# EAGLE design KW2CPU.PCB (EAGLE 6.5.0)
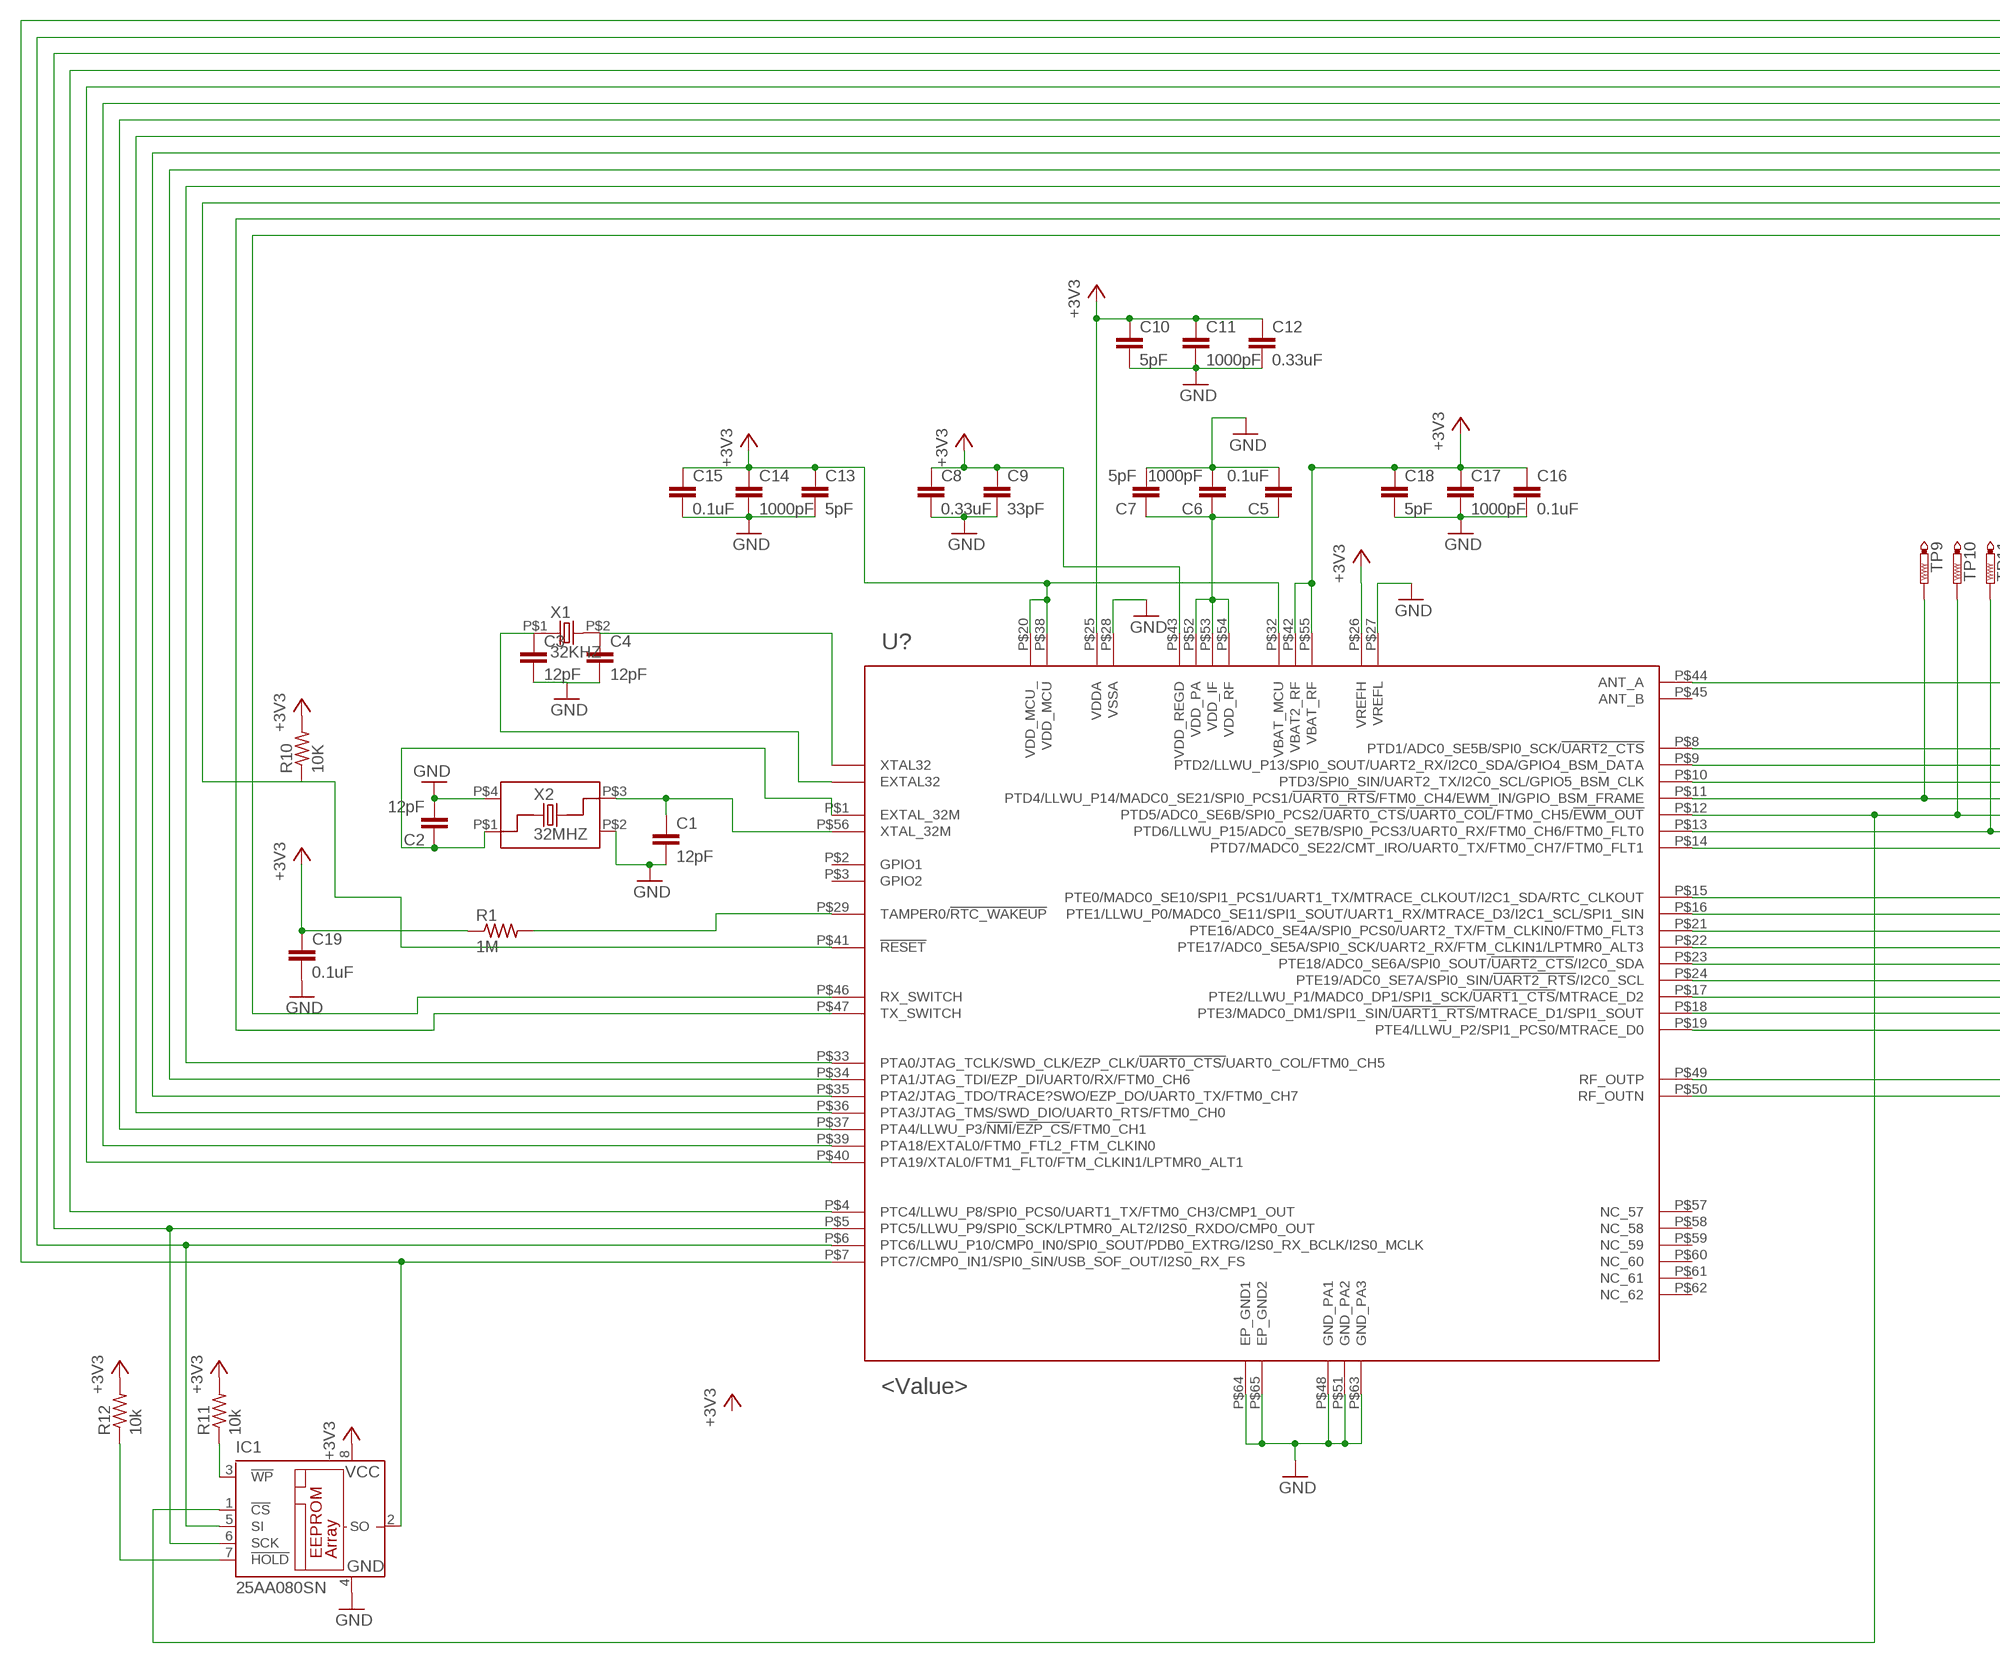
[diagram p0: schematic, sheet 1, part 1 of 2]
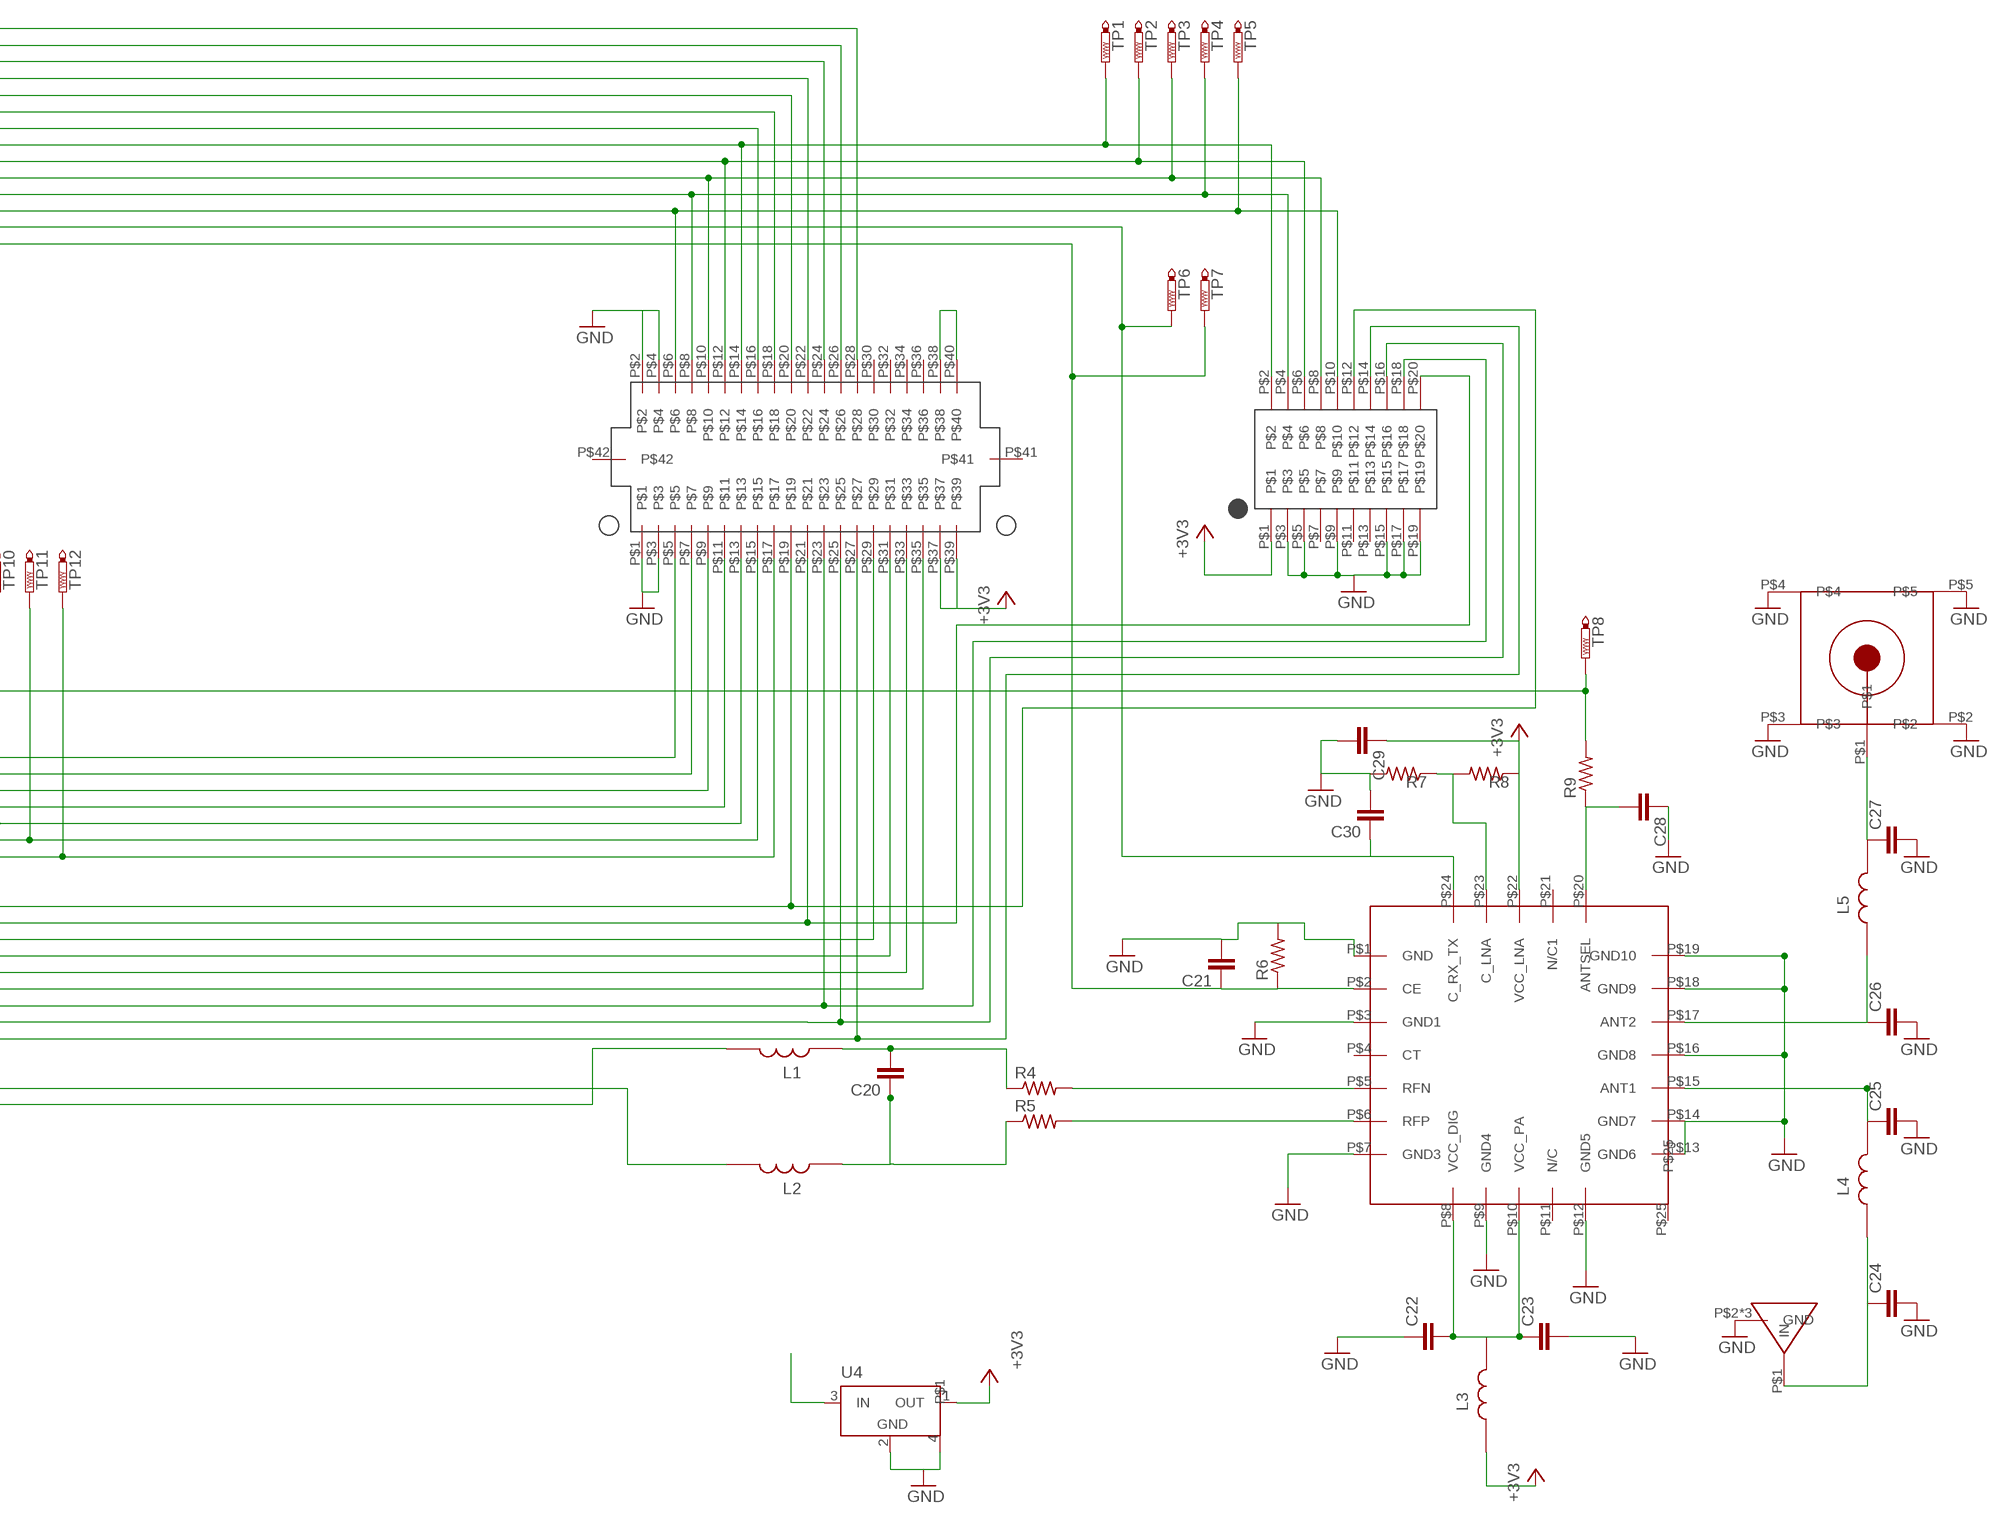
[diagram p1: schematic, sheet 1, part 2 of 2]

## Parts
C1  12pF  RF-C0402  [C0402]
C2  12pF  RF-C0402  [C0402]
C3  12pF  RF-C0402  [C0402]
C4  12pF  RF-C0402  [C0402]
C5  0.1uF  RF-C0402  [C0402]
C6  1000pF  RF-C0402  [C0402]
C7  5pF  RF-C0402  [C0402]
C8  0.33uF  RF-C0402  [C0402]
C9  33pF  RF-C0402  [C0402]
C10  5pF  RF-C0402  [C0402]
C11  1000pF  RF-C0402  [C0402]
C12  0.33uF  RF-C0402  [C0402]
C13  5pF  RF-C0402  [C0402]
C14  1000pF  RF-C0402  [C0402]
C15  0.1uF  RF-C0402  [C0402]
C16  0.1uF  RF-C0402  [C0402]
C17  1000pF  RF-C0402  [C0402]
C18  5pF  RF-C0402  [C0402]
C19  0.1uF  RF-C0402  [C0402]
C20  RF-C  [RF-L0201]
C21  RF-CRFMD  [RFMD0402]
C22  RF-C  [RF-L0201]
C23  RF-C  [RF-L0201]
C24  RF-CRFMD  [RFMD0402]
C25  RF-CRFMD  [RFMD0402]
C26  RF-CRFMD  [RFMD0402]
C27  RF-CRFMD  [RFMD0402]
C28  RF-CRFMD  [RFMD0402]
C29  RF-CRFMD  [RFMD0402]
C30  RF-CRFMD  [RFMD0402]
IC1  25AA080SN  [SO-08]
J1  DF12_M  [DF12_M]
J2  MOLEX55560-0207  [MOLEX55560-0207]
J3  MMCX_VERT  [MMCX_VERT]
L1  RF-L0201  [RF-L0201]
L2  RF-L0201  [RF-L0201]
L3  RF-L  [RFMD0402]
L4  RF-L  [RFMD0402]
L5  RF-L  [RFMD0402]
R1  1M  RF-R0402  [RF-R0402]
R4  RF-R  [RF-L0201]
R5  RF-R  [RF-L0201]
R6  RF-RRFMD  [RFMD0402]
R7  RF-RRFMD  [RFMD0402]
R8  RF-RRFMD  [RFMD0402]
R9  RF-RRFMD  [RFMD0402]
R10  10K  RF-R0402  [RF-R0402]
R11  10k  RF-R0402  [RF-R0402]
R12  10k  RF-R0402  [RF-R0402]
TP1  PTR1TP15R  [TP15R]
TP2  PTR1TP15R  [TP15R]
TP3  PTR1TP15R  [TP15R]
TP4  PTR1TP15R  [TP15R]
TP5  PTR1TP15R  [TP15R]
TP6  PTR1TP15R  [TP15R]
TP7  PTR1TP15R  [TP15R]
TP8  PTR1TP15R  [TP15R]
TP9  PTR1TP15R  [TP15R]
TP10  PTR1TP15R  [TP15R]
TP11  PTR1TP15R  [TP15R]
TP12  PTR1TP15R  [TP15R]
U1  MKW21D  [LGA63]
U3  RF6555  [RF6555]
U4  MCP1804T-3302I  [SOT223]
U5  F-ANTENNA  [F_ANT_RFMD]
X1  32KHZ  [32KHZSMD]
X2  32MHZ  [32MHZSMD]

## Nets
!RESET: J1.P$6 J2.P$10 R10.1 TP5.TP U1.P$41(!RESET)
+3V3: C8.1 C9.1 C10.1 C11.1 C12.1 C13.1 C14.1 C15.1 C16.1 C17.1 C18.1 C19.1 C29.P$1 IC1.8(VCC) J1.P$37 J1.P$39 J2.P$1 L3.P$2 R1.1 R8.P$1 R10.2 R11.2 R12.2 U1.P$20(VDD_MCU_) U1.P$25(VDDA) U1.P$26(VREFH) U1.P$32(VBAT_MCU) U1.P$38(VDD_MCU) U1.P$42(VBAT2_RF) U1.P$43(VDD_REGD) U1.P$55(VBAT_RF) U3.P$22(VCC_LNA) U4.1(OUT)
ANT1: C25.P$1 L4.P$1 U3.P$15(ANT1)
ANT2: C26.P$1 L5.P$2 U3.P$17(ANT2)
ANT_A: R9.P$2 TP8.TP U1.P$44(ANT_A)
ANTSEL: C28.P$2 R9.P$1 U3.P$20(ANTSEL)
C_LNA: R7.P$1 R8.P$2 U3.P$23(C_LNA)
EXTAL32: C3.1 U1.P$31(EXTAL32) X1.P$1
EXTAL_32M: C2.1 U1.P$1(EXTAL_32M) X2.P$1
F_ANT: C24.P$1 L4.P$2 U5.P$1(IN)
GND: C1.2 C2.2 C3.2 C4.2 C5.2 C6.2 C7.2 C8.2 C9.2 C10.2 C11.2 C12.2 C13.2 C14.2 C15.2 C16.2 C17.2 C18.2 C19.2 C21.P$2 C22.P$1 C23.P$2 C24.P$2 C25.P$2 C26.P$2 C27.P$2 C28.P$1 C29.P$2 C30.P$1 IC1.4(GND) J1.P$1 J1.P$2 J1.P$3 J1.P$4 J2.P$3 J2.P$5 J2.P$9 J2.P$15 J2.P$17 J2.P$19 J3.P$2 J3.P$3 J3.P$4 J3.P$5 R6.P$2 R7.P$2 U1.P$27(VREFL) U1.P$28(VSSA) U1.P$48(GND_PA1) U1.P$51(GND_PA2) U1.P$63(GND_PA3) U1.P$64(EP_GND1) U1.P$65(EP_GND2) U3.P$1(GND) U3.P$3(GND1) U3.P$7(GND3) U3.P$9(GND4) U3.P$12(GND5) U3.P$13(GND6) U3.P$14(GND7) U3.P$16(GND8) U3.P$18(GND9) U3.P$19(GND10) U4.2(GND) U4.4 U5.P$2(GND) U5.P$3(GND) U5.P$4(GND) X2.P$2 X2.P$4
MMCX_ANT: C27.P$1 J3.P$1 L5.P$1
N$1: IC1.3(!WP) R11.1
N$2: IC1.7(!HOLD) R12.1
N$4: C20.P$2 L1.P$2 R4.P$1
N$5: C20.P$1 L2.P$2 R5.P$1
N$6: C5.1 C6.1 C7.1 U1.P$52(VDD_PA) U1.P$53(VDD_IF) U1.P$54(VDD_RF)
PTA0/JTAG_TCLK/SWD_CLK/EZP_CLK/!UART0_CTS/!UART0_COL/FTM0_CH5: J1.P$8 J2.P$4 TP4.TP U1.P$33(PTA0/JTAG_TCLK/SWD_CLK/EZP_CLK/!UART0_CTS/!UART0_COL/FTM0_CH5)
PTA1/JTAG_TDI/EZP_DI/UART0/RX/FTM0_CH6: J1.P$10 J2.P$8 TP3.TP U1.P$34(PTA1/JTAG_TDI/EZP_DI/UART0/RX/FTM0_CH6)
PTA2/JTAG_TDO/TRACE?SWO/EZP_DO/UART0_TX/FTM0_CH7: J1.P$12 J2.P$6 TP2.TP U1.P$35(PTA2/JTAG_TDO/TRACE?SWO/EZP_DO/UART0_TX/FTM0_CH7)
PTA3/JTAG_TMS/SWD_DIO/UART0_RTS/FTM0_CH0: J1.P$14 J2.P$2 TP1.TP U1.P$36(PTA3/JTAG_TMS/SWD_DIO/UART0_RTS/FTM0_CH0)
PTA4/LLWU_P3/!NMI!/!EZP_CS!/FTM0_CH1: J1.P$16 U1.P$37(PTA4/LLWU_P3/!NMI!/!EZP_CS!/FTM0_CH1)
PTA18/EXTAL0/FTM0_FTL2_FTM_CLKIN0: J1.P$18 U1.P$39(PTA18/EXTAL0/FTM0_FTL2_FTM_CLKIN0)
PTA19/XTAL0/FTM1_FLT0/FTM_CLKIN1/LPTMR0_ALT1: J1.P$20 U1.P$40(PTA19/XTAL0/FTM1_FLT0/FTM_CLKIN1/LPTMR0_ALT1)
PTC4/LLWU_P8/SPI0_PCS0/UART1_TX/FTM0_CH3/CMP1_OUT: J1.P$22 U1.P$4(PTC4/LLWU_P8/SPI0_PCS0/UART1_TX/FTM0_CH3/CMP1_OUT)
PTC5/LLWU_P8/SPI0_PCS0/UART1_TX/FTM0_CH3/CMP1_OUT: IC1.6(SCK) J1.P$24 U1.P$5(PTC5/LLWU_P9/SPI0_SCK/LPTMR0_ALT2/I2S0_RXDO/CMP0_OUT)
PTC6/LLWU_P10/CMP0_IN0/SPI0_SOUT/PDB0_EXTRG/I2S0_RX_BCLK/I2S0_MCLK: IC1.5(SI) J1.P$26 U1.P$6(PTC6/LLWU_P10/CMP0_IN0/SPI0_SOUT/PDB0_EXTRG/I2S0_RX_BCLK/I2S0_MCLK)
PTC7/CMP0_IN1/SPI0_SIN/USB_SOF_OUT/I2S0_RX_FS: IC1.2(SO) J1.P$28 U1.P$7(PTC7/CMP0_IN1/SPI0_SIN/USB_SOF_OUT/I2S0_RX_FS)
PTD1/ADC0_SE5B/SPI0_SCK/!UART2_CTS: J1.P$5 U1.P$8(PTD1/ADC0_SE5B/SPI0_SCK/!UART2_CTS)
PTD2/LLWU_P13/SPI0_SOUT/UART2_RX/I2C0_SDA/GPIO4_BSM_DATA: J1.P$7 U1.P$9(PTD2/LLWU_P13/SPI0_SOUT/UART2_RX/I2C0_SDA/GPIO4_BSM_DATA)
PTD3/SPI0_SIN/UART2_TX/I2C0_SCL/GPIO5_BSM_CLK: J1.P$9 U1.P$10(PTD3/SPI0_SIN/UART2_TX/I2C0_SCL/GPIO5_BSM_CLK)
PTD4/LLWU_P14/MADC0_SE21/SPI0_PCS1/!UART0_RTS!/FTM0_CH4/EWM_IN/GPIO_BSM_FRAME: J1.P$11 TP9.TP U1.P$11(PTD4/LLWU_P14/MADC0_SE21/SPI0_PCS1/!UART0_RTS!/FTM0_CH4/EWM_IN/GPIO_BSM_FRAME)
PTD5/ADC0_SE6B/SPI0_PCS2/!UART0_CTS!/!UART0_COL!/FTM0_CH5/!EWM_OUT: IC1.1(!CS) J1.P$13 TP10.TP U1.P$12(PTD5/ADC0_SE6B/SPI0_PCS2/!UART0_CTS!/!UART0_COL!/FTM0_CH5/!EWM_OUT)
PTD6/LLWU_P15/ADC0_SE7B/SPI0_PCS3/UART0_RX/FTM0_CH6/FTM0_FLT0: J1.P$15 TP11.TP U1.P$13(PTD6/LLWU_P15/ADC0_SE7B/SPI0_PCS3/UART0_RX/FTM0_CH6/FTM0_FLT0)
PTD7/MADC0_SE22/CMT_IRO/UART0_TX/FTM0_CH7/FTM0_FLT1: J1.P$17 TP12.TP U1.P$14(PTD7/MADC0_SE22/CMT_IRO/UART0_TX/FTM0_CH7/FTM0_FLT1)
PTE0/MADC0_SE10/SPI1_PCS1/UART1_TX/MTRACE_CLKOUT/I2C1_SDA/RTC_CLKOUT: J1.P$19 J2.P$12 U1.P$15(PTE0/MADC0_SE10/SPI1_PCS1/UART1_TX/MTRACE_CLKOUT/I2C1_SDA/RTC_CLKOUT)
PTE1/LLWU_P0/MADC0_SE11/SPI1_SOUT/UART1_RX/MTRACE_D3/I2C1_SCL/SPI1_SIN: J1.P$21 J2.P$20 U1.P$16(PTE1/LLWU_P0/MADC0_SE11/SPI1_SOUT/UART1_RX/MTRACE_D3/I2C1_SCL/SPI1_SIN)
PTE2/LLWU_P1/MADC0_DP1/SPI1_SCK/!UART1_CTS!/MTRACE_D2: J1.P$23 J2.P$18 U1.P$17(PTE2/LLWU_P1/MADC0_DP1/SPI1_SCK/!UART1_CTS!/MTRACE_D2)
PTE3/MADC0_DM1/SPI1_SIN/!UART1_RTS!/MTRACE_D1/SPI1_SOUT: J1.P$25 J2.P$16 U1.P$18(PTE3/MADC0_DM1/SPI1_SIN/!UART1_RTS!/MTRACE_D1/SPI1_SOUT)
PTE4/LLWU_P2/SPI1_PCS0/MTRACE_D0: J1.P$27 J2.P$14 U1.P$19(PTE4/LLWU_P2/SPI1_PCS0/MTRACE_D0)
PTE16/ADC0_SE4A/SPI0_PCS0/UART2_TX/FTM_CLKIN0/FTM0_FLT3: J1.P$29 U1.P$21(PTE16/ADC0_SE4A/SPI0_PCS0/UART2_TX/FTM_CLKIN0/FTM0_FLT3)
PTE17/ADC0_SE5A/SPI0_SCK/UART2_RX/FTM_CLKIN1/LPTMR0_ALT3: J1.P$31 U1.P$22(PTE17/ADC0_SE5A/SPI0_SCK/UART2_RX/FTM_CLKIN1/LPTMR0_ALT3)
PTE18/ADC0_SE6A/SPI0_SOUT/!UART2_CTS!/I2C0_SDA: J1.P$33 U1.P$23(PTE18/ADC0_SE6A/SPI0_SOUT/!UART2_CTS!/I2C0_SDA)
PTE19/ADC0_SE7A/SPI0_SIN/!UART2_RTS!/I2C0_SCL: J1.P$35 U1.P$24(PTE19/ADC0_SE7A/SPI0_SIN/!UART2_RTS!/I2C0_SCL)
RF_OUTN: L1.P$1 U1.P$50(RF_OUTN)
RF_OUTP: L2.P$1 U1.P$49(RF_OUTP)
RFN: R4.P$2 U3.P$5(RFN)
RFP: R5.P$2 U3.P$6(RFP)
RX_SWITCH: C21.P$1 R6.P$1 TP7.TP U1.P$46(RX_SWITCH) U3.P$2(CE)
TAMPER/!RTC_WAKEUP: R1.2 U1.P$29(TAMPER0/!RTC_WAKEUP)
TX_SWITCH: C30.P$2 TP6.TP U1.P$47(TX_SWITCH) U3.P$24(C_RX_TX)
VCC_DIG_PA: C22.P$2 C23.P$1 L3.P$1 U3.P$8(VCC_DIG) U3.P$10(VCC_PA)
VIN: J1.P$38 J1.P$40 U4.3(IN)
XTAL32: C4.1 U1.P$30(XTAL32) X1.P$2
XTAL_32M: C1.1 U1.P$56(XTAL_32M) X2.P$3
Unconnected: J1.P$30 J1.P$32 J1.P$34 J1.P$36 J1.P$41 J1.P$42 J2.P$7 J2.P$11 J2.P$13 U1.P$2(GPIO1) U1.P$3(GPIO2) U1.P$45(ANT_B) U1.P$57(NC_57) U1.P$58(NC_58) U1.P$59(NC_59) U1.P$60(NC_60) U1.P$61(NC_61) U1.P$62(NC_62) U3.P$4(CT) U3.P$11(N/C) U3.P$21(N/C1) U3.P$25

## Library data of the parts
C1-C19 = GW-devices:RF-C: RF capacitor pads for FSL reference design
C20 = GW-devices:RF-C: RF capacitor pads for FSL reference design; MFGN: TDK; MFGP: C0603C0G1E1R2B030BF
C21 C28-C30 = GW-devices:RF-C: RF capacitor pads for FSL reference design; MFGN: Murata; MFGP: GJM1555C1H8R0CB01D
C22 = GW-devices:RF-C: RF capacitor pads for FSL reference design; MFGN: TDK; MFGP: C0603X5R0J105M030BC
C23 = GW-devices:RF-C: RF capacitor pads for FSL reference design; MFGN: TDK; MFGP: C0603C0G1E5R1C030BG
C24 C25 C27 = GW-devices:RF-C: RF capacitor pads for FSL reference design; NOTES: DNP
C26 = GW-devices:RF-C: RF capacitor pads for FSL reference design; NOTE: DNP
IC1 = microchip:25*: Serial EEPROM 4K/ 8K , SPI bus; MF: MICROCHIP; MPN: 25AA080/SN; OC_FARNELL: 1816072; OC_NEWARK: 92C7351
J1 = KW2:DF12_M
J2 = KW2:MOLEX55560-0207
J3 = KW2:MMCX_VERT; MFGN: Molex; MFGP: 0734152061
L1 L2 = GW-devices:RF-L: RF inductor pads for FSL reference design; MFGN: Murata; MFGP: LQP03TN1N0B02
L3 = GW-devices:RF-L: RF inductor pads for FSL reference design; MFGN: Murata; MFGP: BLM15AG100SN1D
L4 L5 = GW-devices:RF-L: RF inductor pads for FSL reference design
R1 R10-R12 = GW-devices:RF-R: RF resistor pads for FSL reference design
R4 R5 = GW-devices:RF-R: RF resistor pads for FSL reference design; MFGN: Panasonic; MFGP: ERJ-1GN0R00C
R6-R9 = GW-devices:RF-R: RF resistor pads for FSL reference design; MFGN: Panasonic; MFGP: ERJ-2GEJ513X
TP1-TP12 = testpad:PTR1: TEST PIN
U1 = ZIGBEE:MKW21D: Freescale's new Kinetis KW20 wireless MCUs expands on the successful Kinetis MCU family based on the ARM® Cortex-M4 CPU core. The Kinetis KW20 Wireless MCU integrates a class-leading RF transceiver, Cortex-M4 and a robust feature set for reliable, secure, and low-power IEEE® 802.15.4 wireless solutions. Product Summary Page: http://www.freescale.com/webapp/sps/site/prod_summary.jsp?code=KW20 Datasheet: http://cache.freescale.com/files/rf_if/doc/data_sheet/MKW22D512V.pdf
U3 = KW2:RF6555; MFGN: RFMD; MFGP: RF6555
U4 = microchip:MCP1804T-3302I: VOLTAGE REGULATOR; MPN: MCP1804T-3302I
U5 = KW2:F-ANTENNA: PCB-base F-Antenna
X1 = KW2:32KHZ
X2 = KW2:32MHZ: 32Mhz crystal for KW2 radio; MFGN: NDK; MFGP: EXS00A-CS02368

## Board
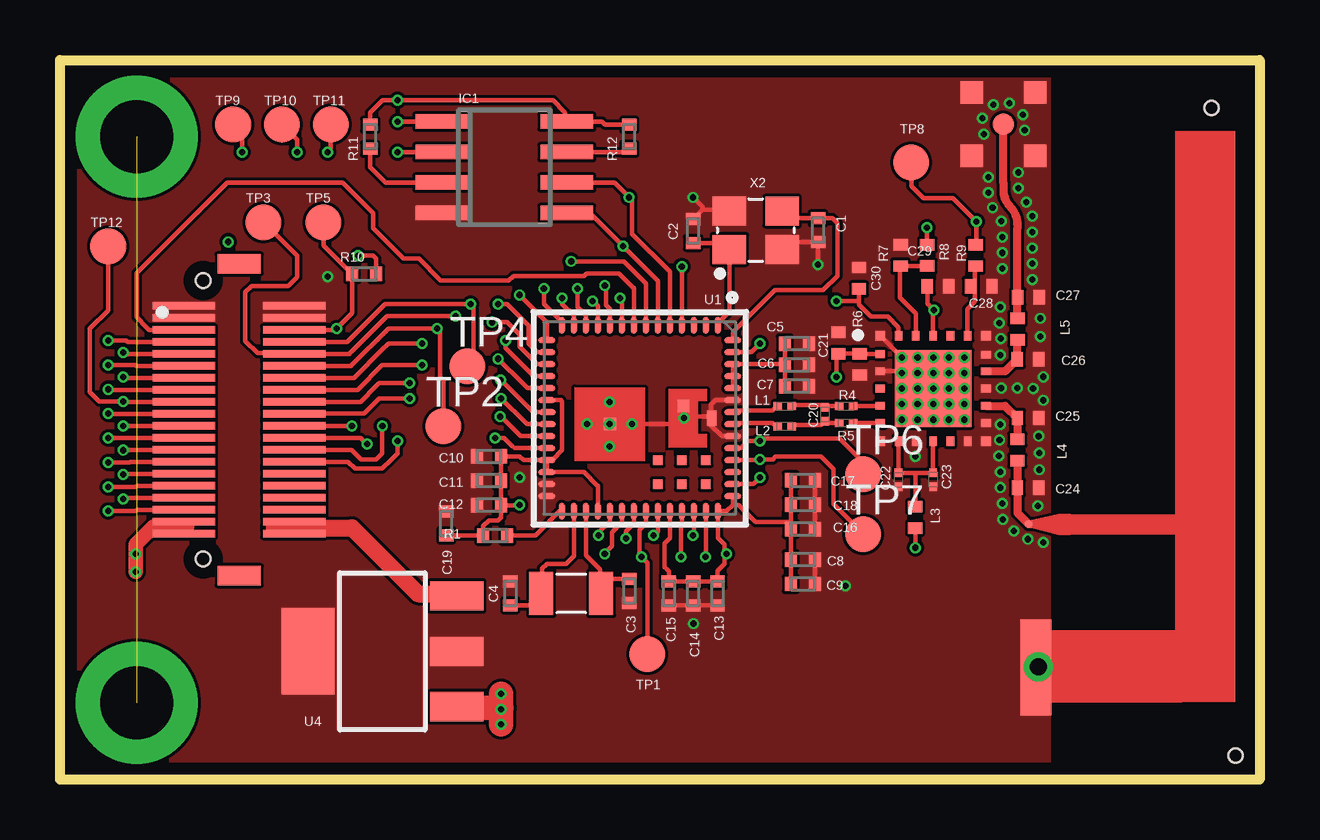
[diagram p2: board, top side]
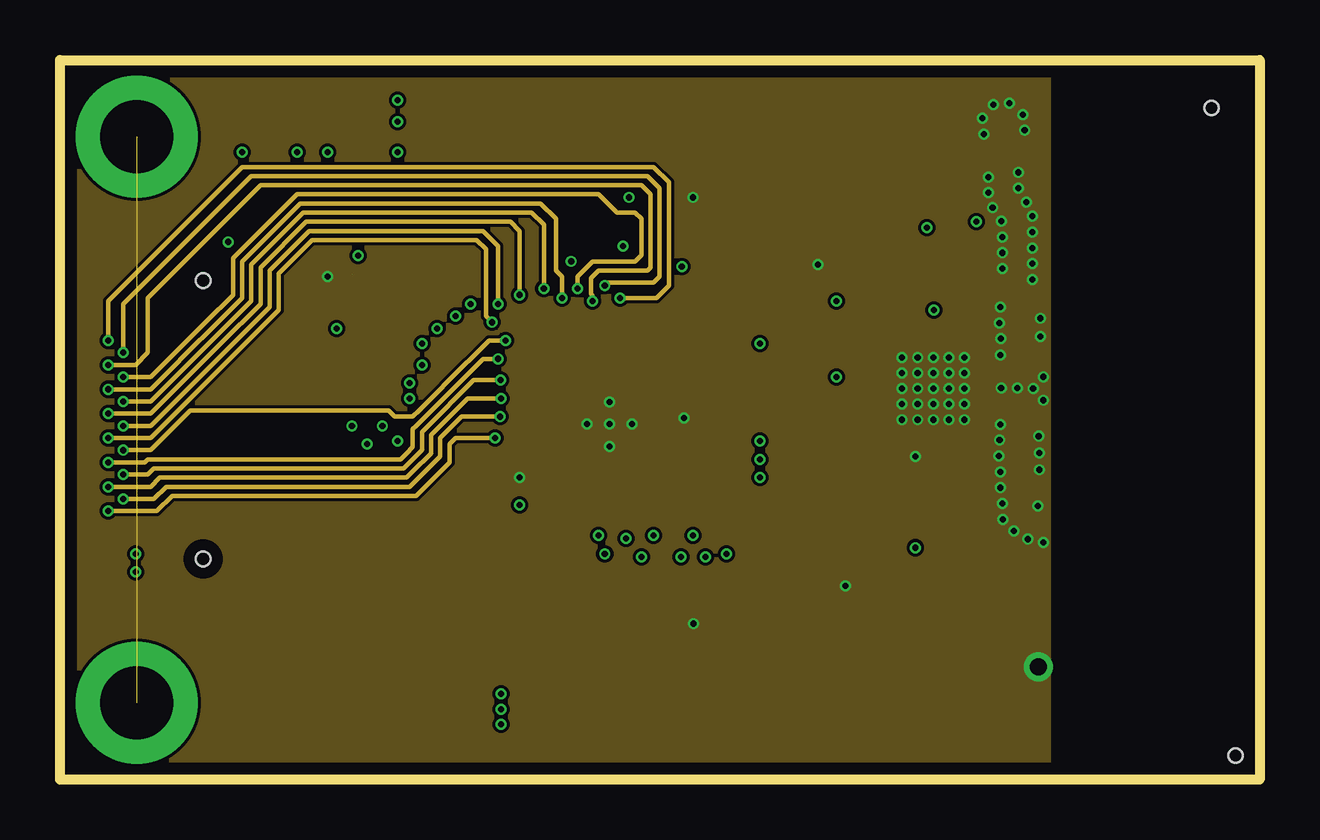
[diagram p3: board, inner layer Route2]
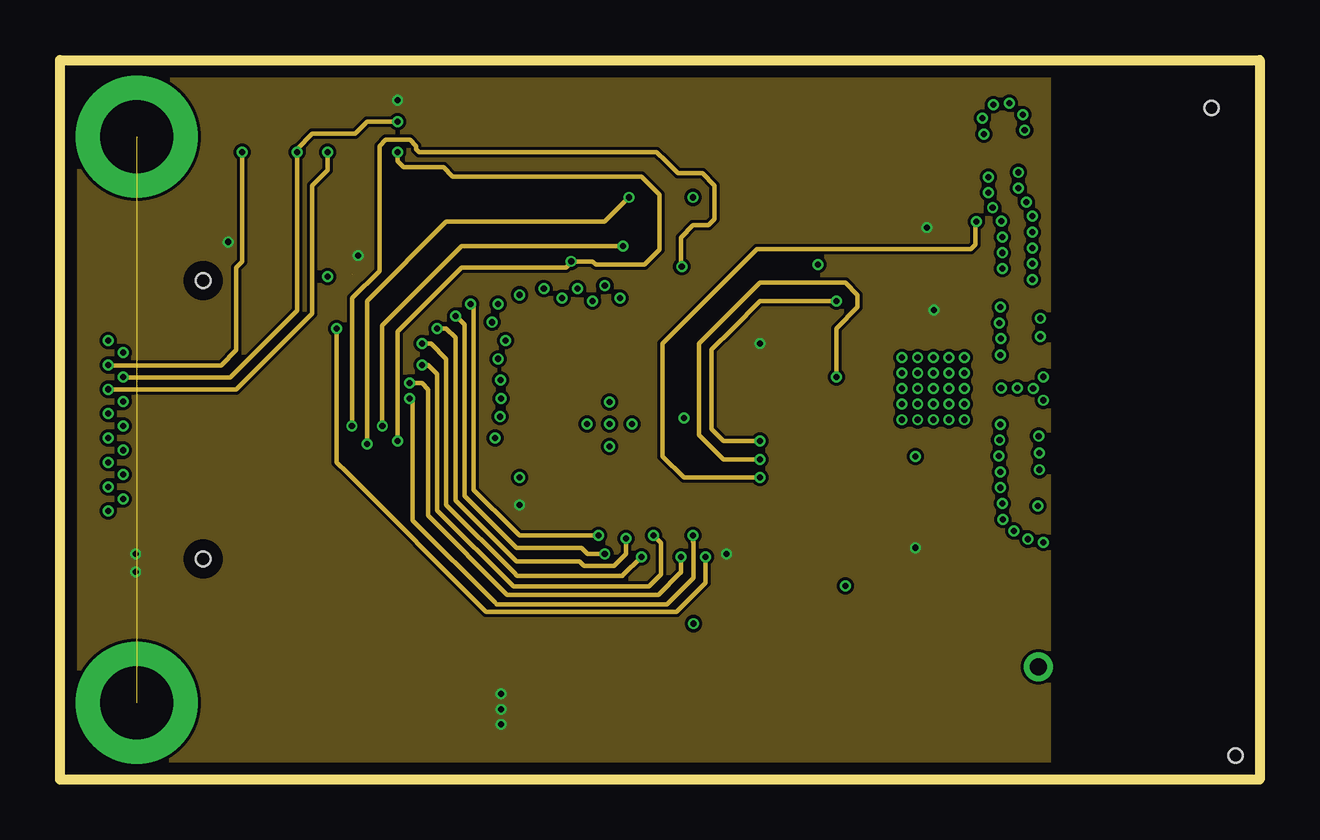
[diagram p4: board, inner layer Route3]
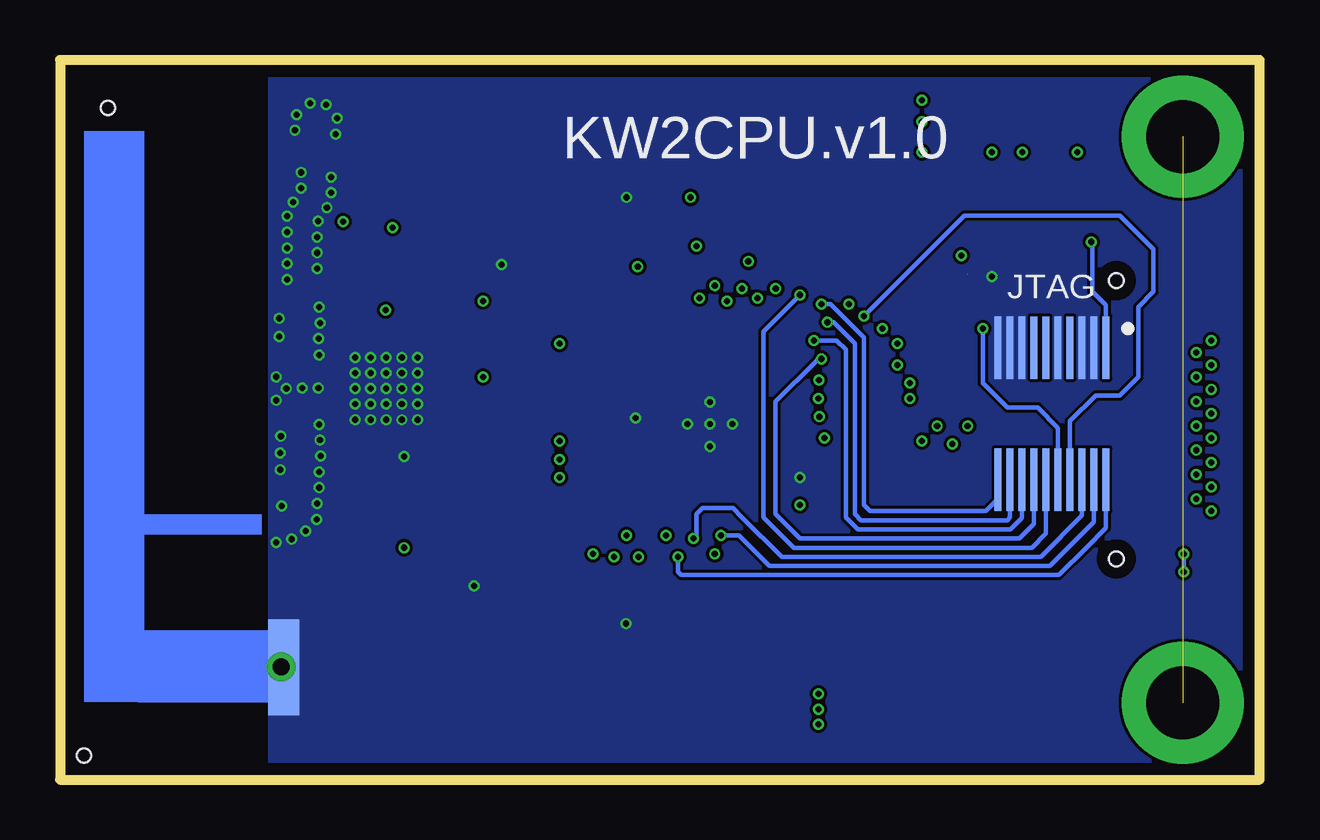
[diagram p5: board, bottom side, seen from below]

Size 50 x 30 mm. Coordinates in mm from the lower left corner, seen from the top.
Outline: 0,30 50,30 50,0 0,0 0,30
Copper layers (1*2*3*16): Top 0.035559375mm / dielectric 10mil / Route2 0.035559375mm / dielectric 38mil / Route3 0.035559375mm / dielectric 10mil / Bottom 0.035559375mm
Design rules "SilverCircuits *": minimum track width 5mil, minimum drill 4mil, track to track 5mil, track to pad 5mil, pad to pad 5mil, via to via 5mil, smd to smd 0mil, copper to edge 20mil, drill to drill 8mil, minimum pad ring 10mil, minimum via ring 4mil, stop-mask expansion 4mil, vias tented up to drill 0mil, thermal gap 10mil
Holes 0.6 mm at 48,28 49,1

### Footprints (pad centres in the part's own frame; a part is rotated, then mirrored left to right if it is on the bottom)
C0402 = smd 0.5 x 0.6: 1 -0.5,0; 2 0.5,0
RF-L0201 = smd 0.33 x 0.356: P$1 0,-0.29; P$2 0,0.29
RFMD0402 = smd 0.475 x 0.6: P$1 -0.445,0; P$2 0.445,0
SO-08 = smd 0.6 x 2.2: 1 -1.905,-2.6; 2 -0.635,-2.6; 3 0.635,-2.6; 4 1.905,-2.6; 5 1.905,2.6; 6 0.635,2.6; 7 -0.635,2.6; 8 -1.905,2.6
DF12_M = smd 0.3 x 2.6: P$1 4.75,2.3; P$2 4.75,-2.3; P$3 4.25,2.3; P$4 4.25,-2.3; P$5 3.75,2.3; P$6 3.75,-2.3; P$7 3.25,2.3; P$8 3.25,-2.3; P$9 2.75,2.3; P$10 2.75,-2.3; P$11 2.25,2.3; P$12 2.25,-2.3; P$13 1.75,2.3; P$14 1.75,-2.3; P$15 1.25,2.3; P$16 1.25,-2.3; P$17 0.75,2.3; P$18 0.75,-2.3; P$19 0.25,2.3; P$20 0.25,-2.3; P$21 -0.25,2.3; P$22 -0.25,-2.3; P$23 -0.75,2.3; P$24 -0.75,-2.3; P$25 -1.25,2.3; P$26 -1.25,-2.3; P$27 -1.75,2.3; P$28 -1.75,-2.3; P$29 -2.25,2.3; P$30 -2.25,-2.3; P$31 -2.75,2.3; P$32 -2.75,-2.3; P$33 -3.25,2.3; P$34 -3.25,-2.3; P$35 -3.75,2.3; P$36 -3.75,-2.3; P$37 -4.25,2.3; P$38 -4.25,-2.3; P$39 -4.75,2.3; P$40 -4.75,-2.3 | smd 0.8 x 1.8: P$41 -6.5,0; P$42 6.5,0 | hole 0.6: -5.8,1.5; 5.8,1.5
MOLEX55560-0207 = smd 0.3 x 2.6: P$1 -2.25,-2.75; P$2 -2.25,2.75; P$3 -1.75,-2.75; P$4 -1.75,2.75; P$5 -1.25,-2.75; P$6 -1.25,2.75; P$7 -0.75,-2.75; P$8 -0.75,2.75; P$9 -0.25,-2.75; P$10 -0.25,2.75; P$11 0.25,-2.75; P$12 0.25,2.75; P$13 0.75,-2.75; P$14 0.75,2.75; P$15 1.25,-2.75; P$16 1.25,2.75; P$17 1.75,-2.75; P$18 1.75,2.75; P$19 2.25,-2.75; P$20 2.25,2.75
MMCX_VERT = smd 0.89 x 0.89: P$1 0,0 | smd 0.94 x 0.94: P$2 -1.32,1.32; P$3 1.32,1.32; P$4 1.32,-1.32; P$5 -1.32,-1.32
RF-R0402 = smd 0.5 x 0.6: 1 -0.5,0; 2 0.5,0
TP15R = smd 1.5 x 1.5: TP 0,0
LGA63 = smd 0.711 x 0.254: P$1 0.125,7.25; P$2 0.125,6.75; P$3 0.125,6.25; P$4 0.125,5.75; P$5 0.125,5.25; P$6 0.125,4.75; P$7 0.135,4.25; P$8 0.135,3.75; P$9 0.125,3.25; P$10 0.125,2.75; P$11 0.125,2.25; P$12 0.125,1.75; P$13 0.125,1.25; P$14 0.125,0.75; P$29 7.875,0.75; P$30 7.875,1.25; P$31 7.875,1.75; P$32 7.875,2.25; P$33 7.875,2.75; P$34 7.875,3.25; P$35 7.885,3.75; P$36 7.885,4.25; P$37 7.875,4.75; P$38 7.875,5.25; P$39 7.875,5.75; P$40 7.875,6.25; P$41 7.875,6.75; P$42 7.875,7.25 | smd 0.254 x 0.711: P$15 0.75,0.125; P$16 1.25,0.125; P$17 1.75,0.125; P$18 2.25,0.125; P$19 2.75,0.125; P$20 3.25,0.125; P$21 3.75,0.135; P$22 4.25,0.135; P$23 4.75,0.125; P$24 5.25,0.125; P$25 5.75,0.125; P$26 6.25,0.125; P$27 6.75,0.125; P$28 7.25,0.125; P$43 7.25,7.875; P$44 6.75,7.875; P$45 6.25,7.875; P$46 5.75,7.875; P$47 5.25,7.874; P$48 4.751,7.874; P$49 4.25,7.874; P$50 3.75,7.875; P$51 3.25,7.875; P$52 2.75,7.875; P$53 2.25,7.875; P$54 1.75,7.875; P$55 1.25,7.875; P$56 0.75,7.875 | smd 0.406 x 0.406: P$57 5.75,6.75; P$58 6.75,6.75; P$59 5.75,5.75; P$60 6.75,5.75; P$61 5.75,4.75; P$62 6.75,4.75 | smd 0.66 x 0.406: P$63 4,7 | smd 0.5 x 0.5: P$64 3.5,5.812; P$65 4.25,2.75
RF6555 = smd 0.4 x 0.4: P$1 -2.2,2.2; P$7 -2.2,-2.2; P$13 2.2,-2.2; P$19 2.2,2.2 | smd 0.4 x 0.32: P$2 -2.2,1.44; P$3 -2.2,0.72; P$4 -2.2,0; P$5 -2.2,-0.72; P$6 -2.2,-1.44; P$14 2.2,-1.44; P$15 2.2,-0.72; P$16 2.2,0; P$17 2.2,0.72; P$18 2.2,1.4 | smd 0.32 x 0.4: P$8 -1.44,-2.2; P$9 -0.72,-2.2; P$10 0,-2.2; P$11 0.72,-2.2; P$12 1.44,-2.2; P$20 1.44,2.2; P$21 0.72,2.2; P$22 0,2.2; P$23 -0.72,2.2; P$24 -1.44,2.2 | smd 3.2 x 3.2: P$25 0,0
SOT223 = smd 1.219 x 2.235: 1 -2.311,-3.099; 2 0,-3.099; 3 2.311,-3.099 | smd 3.6 x 2.2: 4 0,3.099
F_ANT_RFMD = smd 0.333 x 0.333: P$1 -3.912,2.68 | smd 1.3 x 4 bottom: P$2 -3.609,-3.302 | drill 0.711 pad 0.965: P$3 -3.501,-3.272 | smd 1.3 x 4: P$4 -3.609,-3.302
32KHZSMD = smd 1 x 1.8: P$1 1.25,0; P$2 -1.25,0
32MHZSMD = smd 1.4 x 1.2: P$1 -1.1,-0.8; P$2 1.1,-0.8; P$3 1.1,0.8; P$4 -1.1,0.8

### Placement (x,y rotation side)
C1  31.6,22.9 270 top
C2  26.39,22.87 90 top
C3  23.73,7.86 270 top
C4  18.77,7.76 90 top
C5  30.71,18.18 0 top
C6  30.71,17.29 0 top
C7  30.71,16.4 0 top
C8  30.96,9.17 0 top
C9  30.96,8.16 0 top
C10  17.88,13.48 180 top
C11  17.88,12.46 180 top
C12  17.88,11.44 180 top
C13  27.41,7.76 270 top
C14  26.39,7.76 270 top
C15  25.38,7.76 270 top
C16  30.96,10.44 0 top
C17  30.96,12.48 0 top
C18  30.96,11.46 0 top
C19  16.1,10.68 90 top
C20  31.88,15.22 0 top
C21  32.45,18.19 90 top
C22  34.95,12.5 0 top
C23  36.39,12.5 180 top
C24  40.35,12.17 0 top
C25  40.35,15.07 0 top
C26  40.34,17.52 0 top
C27  40.37,20.11 0 top
C28  38.4,20.57 180 top
C29  36.6,20.56 0 top
C30  33.3,20.9 270 top
IC1  18.52,25.52 270 top
J1  7.47,15 90 top
J2  8.65,15.25 180 bottom
J3  39.32,27.32 0 top
L1  30.22,15.56 270 top
L2  30.22,14.73 270 top
L3  35.65,10.93 270 top
L4  39.91,13.74 270 top
L5  39.91,18.78 270 top
R1  18.14,10.17 0 top
R4  32.77,15.56 270 top
R5  32.77,14.86 270 top
R6  33.33,17.31 270 top
R7  35.04,21.85 90 top
R8  36.15,21.85 270 top
R9  38.16,21.85 90 top
R10  12.68,21.08 0 top
R11  12.93,26.8 90 top
R12  23.73,26.8 90 top
TP1  24.49,5.24 0 top
TP2  15.99,14.74 0 top
TP3  8.49,23.24 0 top
TP4  16.99,17.24 0 top
TP5  10.99,23.24 0 top
TP6  33.49,12.74 0 top
TP7  33.49,10.24 0 top
TP8  35.49,25.74 0 top
TP9  7.22,27.3 0 top
TP10  9.25,27.3 0 top
TP11  11.28,27.3 0 top
TP12  2.01,22.22 0 top
U1  20.17,19.06 270 top
U3  36.39,16.3 0 top
U4  13.44,5.35 90 top
U5  44.28,7.97 0 top
X1  21.31,7.76 0 top
X2  29,22.9 0 top

### Tracks (layer width: path | path; a pad name or v marks a point on that pad's centre or on a via)
!RESET  (via drill 0.25)  (1 unrouted)
  Top 0.178: U1.P$41 26.92,9.3 v26.9,9.29 | J1.P$6 11.47,18.75 v11.53,18.81 12.17,19.45 12.17,20.32 | TP5.TP 10.99,22.26 R10.1 12.17,20.32 | 12.17,20.57 12.17,20.32
  Route3 0.178: v11.53,18.81 11.53,13.22 11.54,13.21 11.96,12.79 17.75,7 25.7,7 26.9,8.2 v26.9,9.29
  Bottom 0.178: J2.P$10 8.4,14.66 9.25,15.51 10.52,15.51 11.53,16.52 v11.53,18.81
+3V3  (via drill 0.25, 0.25 pad 0.46)
  Top 0.178: U1.P$25 U1.P$26 21.84,12.81 22.39,12.26 22.42,12.23 U1.P$32 | C17.1 C18.1 30.46,10.74 | 36.2,20.52 C29.P$1 36.15,19.84 v36.42,19.57 36.39,19.54 U3.P$22 | C9.1 C8.1 C16.1 30.46,10.74 | 27.7,9.41 27.7,9.8 27.42,10.08 U1.P$42 27.79,11.19 28.04,11.44 | 27.7,9.41 27.7,9 27.4,8.7 C13.1 C14.1 C15.1 25.38,8.68 25.27,8.78 25.2,8.85 25.2,9.85 25.39,10.04 25.42,10.07 U1.P$38 | J1.P$37 5.17,10.55 | 5.17,10.55 J1.P$39 | U1.P$20 20.88,15.81 20.93,15.76 20.93,13.73 20.55,13.35 20.3,13.35 20.29,13.34 U1.P$25 | U1.P$25 19.31,13.31 19.15,13.48 C10.1 C11.1 C12.1 18.39,11.44 | C19.1 R1.1 17.64,10.56 17.88,10.81 18.26,10.81 18.39,10.94 18.39,11.44 | 28.04,11.44 U1.P$43 | v27.79,9.41 27.7,9.41 | 5.31,10.55 5.17,10.55 | 16.58,2.99 U4.1 | U1.P$55 28.82,17.81 v29.18,18.18 | L3.P$2 35.65,9.68 v35.66,9.67 | v18.39,2.93 18.39,2.97 18.41,2.99 | 18.39,11.44 19.14,11.44 v19.15,11.44 | R8.P$1 v36.14,23.02 | 28.04,11.44 28.28,11.44 28.99,10.74 30.46,10.74 | R12.2 22.72,27.3 22.59,27.43 IC1.8 21.06,27.49 21.06,27.81 20.55,28.32 v14.08,28.32 13.82,28.32 13.44,28.32 12.93,27.81 R11.2 | v12.42,21.84 13.06,21.84 13.19,21.71 R10.2
  Top 0.61: 5.31,10.55 5.17,10.55 3.91,10.55 3.15,9.79 v3.15,9.41 v3.15,8.65
  Top 1.016: v18.39,3.57 v18.39,2.93 v18.39,2.3 | 18.41,2.99 16.58,2.99
  Bottom 0.178: v3.15,9.41 v3.15,8.65 | J2.P$1 6.4,19.77 6.96,20.33 6.96,21.22 6.96,22.37 v7.01,22.42
  pour Route3 (no thermals): 41.2,2.89 41.2,31.51 -2.37,31.51 -2.37,-1.63 41.2,-1.63 41.2,2.9
ANT1
  Top 0.333: U3.P$15 39.39,15.58 C25.P$1 L4.P$1 39.91,14.11
ANT2
  Top 0.333: U3.P$17 39.4,17.02 39.51,17.13 39.54,17.16 C26.P$1 39.9,18.14 39.91,18.14 L5.P$2
ANT_A  (via drill 0.25)
  Top 0.178: R9.P$2 38.2,22.3 v38.2,23.25 37.22,24.24 35.99,24.24 35.49,24.74 TP8.TP | U1.P$44 28.91,12.31 v29.18,12.59
  Route3 0.178: v29.18,12.59 27.53,12.59 26.01,12.59 25.12,13.48 25.12,18.18 29.06,22.11 37.98,22.11 R9.P$2 38.16,23.21 v38.2,23.25
ANTSEL
  Top 0.178: U3.P$20 37.83,19.61 38.14,19.92 38.14,20.53 | 38.14,20.53 38.14,21.38 R9.P$1 | C28.P$2 38.1,20.57 38.14,20.53
C_LNA
  Top 0.178: R8.P$2 R7.P$1 35,21.37 35,20.1 35.67,19.43 U3.P$23
EXTAL32
  Top 0.178: 22.5,8.38 22.5,8.7 22.5,8.76 21.92,9.34 U1.P$31 | 22.5,8.38 22.5,7.95 | 22.7,7.75 22.57,7.75 X1.P$1 | C3.1 22.52,8.36 22.5,8.38
  Top 0.254: 22.5,7.95 22.7,7.75
EXTAL_32M
  Top 0.178: C2.1 27.63,22.37 X2.P$1 27.9,19.52 27.42,19.03 U1.P$1
  Top 0.254: 27.6,22.4 X2.P$1
F_ANT
  Top 0.333: C24.P$1 | C24.P$1 39.91,11.11 U5.P$1 | L4.P$2 39.91,13.23 39.91,12.47 C24.P$1
GND  (via drill 0.25, 0.25 pad 0.46)
  Top 0.178: C15.2 C14.2 C13.2 | C8.2 C9.2 | C17.2 C18.2 C16.2 | 27.14,15 27.14,14.76 27.59,14.31 U1.P$48 | 27.14,15 27.14,15.13 | 27.14,15.13 27.14,15.63 27.33,15.81 U1.P$51 | 27.14,15.13 26.24,15.13 25.99,14.88 25.93,14.81 U1.P$65 | 30.4,22.4 C1.2 v31.6,21.48 | 25.95,15.42 25.95,15.54 U1.P$64 | U1.P$63 27.17,15.03 27.14,15 | 26.77,23.76 27.84,23.76 X2.P$4 | 26.77,23.76 26.77,23.89 v26.39,24.27 | C2.2 26.77,23.76 | U3.P$3 35.03,17.02 v35.1,16.95 | U3.P$1 v35.1,17.6
  Top 0.254: 25.95,15.42 26.24,15.13 | 30.4,22.4 X2.P$2
  other vias: 37.05,15.65 37.7,15.65 35.1,15 35.75,15 36.4,15 37.05,15 37.7,15 35.75,17.6 36.4,17.6 37.05,17.6 37.7,17.6 35.75,16.95 36.4,16.95 37.05,16.95 37.7,16.95 35.1,16.3 35.75,16.3 36.4,16.3 37.05,16.3 37.7,16.3 35.1,15.65 35.75,15.65 36.4,15.65 32.74,8.07 26.4,6.5 19.15,12.59 35.66,13.48 22.91,14.82 26.01,15.08 21.97,14.82 23.85,14.82 22.91,15.74 22.91,13.88 39.23,16.32 39.9,16.32 40.98,16.79 40.98,15.81 40.86,18.47 40.86,19.23 40.53,20.84 40.53,21.5 40.53,22.16 40.53,22.82 40.53,23.48 40.28,24.08 39.21,17.71 39.17,14.15 39.15,19.04 39.19,19.7 39.28,21.3 39.28,21.96 39.28,22.62 39.24,23.28 38.88,23.84 39.95,24.65 39.14,13.49 39.19,12.83 39.21,12.17 39.28,11.51 39.31,10.85 39.76,10.36 40.34,10.02 40.98,9.88 40.79,14.31 40.82,13.62 40.77,11.41 40.82,12.92 39.94,25.31 39.22,18.38 38.7,24.46 38.7,25.12 38.51,26.91 38.44,27.57 38.91,28.13 39.57,28.2 40.13,27.73 40.21,27.06 39.21,14.81 40.56,16.3 11.15,20.97
  pour Bottom (no thermals): 41.2,2.89 41.2,31.51 -2.37,31.51 -2.37,-1.63 41.2,-1.63 41.2,2.9
  pour Top (no thermals): 41.2,2.89 41.2,31.51 -2.37,31.51 -2.37,-1.63 41.2,-1.63 41.2,2.9
  pour Route2 (no thermals): 41.2,2.89 41.2,31.51 -2.37,31.51 -2.37,-1.63 41.2,-1.63 41.2,2.9
MMCX_ANT
  Top 0.333: L5.P$1 39.91,19.84 39.9,19.84 39.9,19.98 39.92,20 C27.P$1 39.91,20.13 39.91,22.64 39.91,22.95 39.91,23.15 arc45 39.6,23.89 arc-45 39.32,24.55 39.32,24.85 J3.P$1
N$1
  Top 0.178: IC1.3 14.33,24.89 13.57,24.89 12.93,25.52 R11.1 | IC1.3 15.98,24.89 | 15.98,24.89 16.11,24.89 | IC1.3 15.98,24.89
N$2
  Top 0.178: IC1.7 23.59,26.16 R12.1
N$4
  Top 0.178: L1.P$2 30.56,15.62 31.27,15.62 31.73,15.62 31.78,15.62 C20.P$2 31.93,15.56 R4.P$1
N$5
  Top 0.178: R5.P$1 32.31,14.86 31.95,14.86 31.95,14.93 C20.P$1 31.73,14.78 31.66,14.78 30.88,14.78 30.56,14.78 L2.P$2
N$6
  Top 0.178: C5.1 C6.1 | C6.1 C7.1 | U1.P$52 U1.P$53 U1.P$54 30.18,17.31 C6.1 | C6.1 | C6.1 30.07,17.41 | 30.07,17.41 C6.1 | C6.1 30.2,17.16 30.2,17.41 | 30.2,17.41 30.07,17.41 | 30.07,17.41 30.2,17.41
N$55  (via drill 3.05 pad 5.08)  (1 unrouted)
  other vias: 3.2,26.8 3.2,3.2
PTA0/JTAG_TCLK/SWD_CLK/EZP_CLK/!UART0_CTS/!UART0_COL/FTM0_CH5  (via drill 0.25)
  Top 0.178: J1.P$8 11.82,18.25 | 11.82,18.25 11.97,18.25 | 11.97,18.25 11.82,18.25 | 11.82,18.25 11.97,18.25 | 11.97,18.25 13.44,19.72 13.54,19.83 13.95,19.83 v17.12,19.83 17.25,19.7 17.25,17.91 16.58,17.24 TP4.TP | U1.P$33 22.92,10.77 22.45,10.3 v22.45,10.18 v22.45,10.17
  Route3 0.178: v22.45,10.17 22.42,10.17 19.41,10.17 19.15,10.17 18.9,10.43 17.25,12.08 17.25,19.76 17.18,19.83 v17.12,19.83
  Bottom 0.178: J2.P$4 6.9,10.74 8.74,8.9 20.42,8.9 21.69,10.17 v22.45,10.17
PTA1/JTAG_TDI/EZP_DI/UART0/RX/FTM0_CH6  (via drill 0.25)
  Top 0.178: 11.94,17.75 12.02,17.75 | 12.02,17.75 11.94,17.75 | 11.94,17.75 12.02,17.75 | 11.94,17.75 J1.P$10 9.74,17.78 8.23,17.78 7.73,18.29 7.73,20.32 7.98,20.57 9.25,20.57 9.5,20.57 9.88,20.95 9.88,21.84 TP3.TP | v16.48,19.32 13.63,19.32 13.61,19.3 12.07,17.75 12.02,17.75 | v22.71,9.41 22.71,9.46 23,9.75 23,10.3 23.39,10.69 23.42,10.72 U1.P$34
  Route3 0.178: v22.71,9.41 21.99,9.41 21.95,9.45 21.73,9.67 21.61,9.67 19.15,9.67 19.02,9.67 16.87,11.82 16.87,18.56 16.87,18.71 16.87,18.96 16.51,19.32 v16.48,19.32
  Bottom 0.178: J2.P$8 7.9,14.95 6.83,16.02 5.82,16.02 5.05,16.78 5.05,19.7 4.42,20.33 4.42,22.11 5.82,23.51 12.29,23.51 v16.48,19.32
PTA2/JTAG_TDO/TRACE?SWO/EZP_DO/UART0_TX/FTM0_CH7  (via drill 0.25)
  Top 0.178: v23.6,10.05 23.6,10.35 23.89,10.64 23.92,10.67 U1.P$35 | J1.P$12 12.13,17.25 12.14,17.26 13.69,18.81 15.51,18.81 v15.72,18.81 15.85,18.68 15.85,16.76 15.99,16.63 TP2.TP
  Route3 0.178: 15.77,18.81 v15.72,18.81 15.77,18.81 | 15.77,18.81 16.1,18.81 16.48,18.43 16.48,18.18 16.48,17.92 16.48,11.64 19.02,9.1 21.65,9.1 21.85,8.9 23.1,8.9 23.6,9.4 v23.6,10.04 v23.6,10.05
  Bottom 0.178: J2.P$6 7.4,11 9.12,9.29 19.91,9.29 21.56,10.94 21.95,11.32 23.22,11.32 23.47,11.06 23.47,10.17 v23.6,10.05
PTA3/JTAG_TMS/SWD_DIO/UART0_RTS/FTM0_CH0  (via drill 0.25)
  Top 0.178: J1.P$14 12.16,16.75 | 12.16,16.75 12.27,16.75 | 12.27,16.75 12.16,16.75 | 12.16,16.75 12.27,16.75 | 12.27,16.75 13.44,17.92 13.69,18.18 14.98,18.18 v15.09,18.18 | U1.P$36 24.42,10.67 24.39,10.64 24.15,10.4 24.15,9.4 24.23,9.32 v24.23,9.29 24.49,9.03 TP1.TP
  Route3 0.178: v15.09,18.18 15.18,18.18 15.47,18.18 16.1,17.54 16.1,17.29 16.1,11.44 18.92,8.63 19.05,8.5 19.28,8.5 23.45,8.5 v24.23,9.29
  Bottom 0.178: J2.P$2 6.4,10.48 7.21,9.67 8.36,8.52 24.11,8.52 24.23,8.65 v24.23,9.29
PTA4/LLWU_P3/!NMI!/!EZP_CS!/FTM0_CH1  (via drill 0.25)
  Top 0.178: J1.P$16 12.4,16.25 13.44,17.29 v15.09,17.29 | U1.P$37 24.92,10.35 v24.74,10.17
  Route3 0.178: v15.09,17.29 15.34,17.29 15.72,16.91 15.72,11.22 18.9,8.05 24.55,8.05 25.05,8.55 25.05,9.85 25.05,9.86 v24.74,10.17
PTA18/EXTAL0/FTM0_FTL2_FTM_CLKIN0  (via drill 0.25)
  Top 0.178: J1.P$18 12.54,15.75 13.18,16.4 13.31,16.52 14.6,16.52 v14.58,16.52 | U1.P$39 25.92,10.72 25.88,10.68 v25.88,9.29
  Route3 0.178: v14.58,16.52 14.75,16.52 15.09,16.52 15.34,16.27 15.34,16.02 15.34,11.01 18.64,7.7 24.95,7.7 25.85,8.61 25.88,8.64 v25.88,9.29
PTA19/XTAL0/FTM1_FLT0/FTM_CLKIN1/LPTMR0_ALT1  (via drill 0.25)
  Top 0.178: v14.58,15.89 14.6,15.89 13.31,15.89 12.68,15.25 9.71,15.25 J1.P$20 | U1.P$40 26.42,10.2 v26.39,10.17
  Route3 0.178: v26.39,10.17 26.39,9.91 26.4,9.9 26.4,9.8 26.4,8.42 25.3,7.31 18.39,7.31 18.2,7.31 18.14,7.38 14.71,10.81 14.71,10.87 14.71,15.76 14.71,15.77 v14.59,15.89 v14.58,15.89
PTC4/LLWU_P8/SPI0_PCS0/UART1_TX/FTM0_CH3/CMP1_OUT  (via drill 0.25)
  Top 0.178: U1.P$4 25.92,21.33 v25.92,21.38 | J1.P$22 v12.17,14.75
  Route3 0.178: 25.11,25.92 25.25,25.78 | 25.25,25.78 25.76,25.27 26.78,25.27 27.28,24.76 27.28,23.37 27.03,23.11 26.39,23.11 25.89,22.6 25.89,21.41 v25.92,21.38 | 25.25,25.78 24.87,26.16 14.96,26.16 14.84,26.29 14.84,26.41 14.58,26.67 13.57,26.67 13.31,26.41 13.31,25.91 13.31,21.21 12.17,20.06 v12.17,14.75
PTC5/LLWU_P8/SPI0_PCS0/UART1_TX/FTM0_CH3/CMP1_OUT  (via drill 0.25)
  Top 0.178: J1.P$24 12.54,14.25 v12.8,13.98 | v23.72,24.27 23.85,24.14 23.85,22.75 25.38,21.22 25.42,21.18 U1.P$5 | 23.6,24.4 v23.72,24.27 | IC1.6 23.11,24.89 v23.72,24.27
  Route3 0.178: v12.8,13.98 12.8,19.95 16.1,23.25 16.23,23.25 22.71,23.25 v23.72,24.27
PTC6/LLWU_P10/CMP0_IN0/SPI0_SOUT/PDB0_EXTRG/I2S0_RX_BCLK/I2S0_MCLK  (via drill 0.25)
  Top 0.178: J1.P$26 12.15,13.75 12.55,13.35 13.18,13.35 13.31,13.48 13.44,13.6 v13.44,14.75 | U1.P$6 24.92,20.79 24.89,20.82 v23.47,22.24 23.04,22.67 | 22.95,22.75 23.04,22.67 | IC1.5 22.09,23.62 23.04,22.67
  Route3 0.178: v23.47,22.24 16.74,22.24 13.44,18.94 13.44,18.68 13.44,15.13 v13.44,14.75
PTC7/CMP0_IN1/SPI0_SIN/USB_SOF_OUT/I2S0_RX_FS  (via drill 0.25)
  Top 0.178: J1.P$28 12.01,13.25 12.29,12.97 13.31,12.97 13.44,12.97 13.82,13.35 14.07,13.6 v14.07,14.11 | v21.31,21.6 23.5,21.6 24.4,20.7 24.42,20.68 U1.P$7 | IC1.2 14.71,26.16 14.58,26.16 v14.08,26.16
  Route3 0.178: v14.07,14.11 14.07,14.24 14.07,15.51 14.07,15.63 14.07,18.56 14.07,18.68 16.74,21.35 21.1,21.35 21.31,21.56 v21.31,21.6 21.44,21.6 22.2,21.6 22.35,21.46 24.36,21.46 25,22.1 25,24.38 24.24,25.14 16.36,25.14 15.98,25.52 14.58,25.52 14.33,25.52 14.08,25.78 v14.08,26.16
PTD1/ADC0_SE5B/SPI0_SCK/!UART2_CTS
  Top 0.178: 6.3,18.75 J1.P$5 3.72,18.75 3.59,18.87 | 3.59,18.87 3.19,19.28 3.19,19.43 3.19,20.89 3.19,21.12 6.96,24.89 11.79,24.89 13.06,23.62 13.06,22.98 14.33,21.71 14.96,21.71 15.85,20.83 15.88,20.8 16.41,20.8 18.7,20.8 18.9,21 21.85,21 21.95,21.1 23.3,21.1 23.89,20.51 23.92,20.48 U1.P$8 | 3.59,18.87 3.66,18.81
PTD2/LLWU_P13/SPI0_SOUT/UART2_RX/I2C0_SDA/GPIO4_BSM_DATA  (via drill 0.25)
  Top 0.178: J1.P$7 2.82,18.25 2.77,18.3 v2.01,18.3 | U1.P$9 23.42,20 v23.34,20.08
  Route2 0.178: v23.34,20.08 24.87,20.08 25.38,20.59 25.38,24.91 24.74,25.54 7.59,25.54 2.01,19.95 v2.01,18.3
PTD3/SPI0_SIN/UART2_TX/I2C0_SCL/GPIO5_BSM_CLK  (via drill 0.25)
  Top 0.178: J1.P$9 2.69,17.75 v2.64,17.79 | U1.P$10 22.92,19.62 22.76,19.77 22.76,20.54 v22.71,20.59
  Route2 0.178: v22.71,20.59 22.84,20.71 24.74,20.71 24.99,20.97 24.99,24.65 24.49,25.16 7.98,25.16 2.64,19.83 v2.64,17.79
PTD4/LLWU_P14/MADC0_SE21/SPI0_PCS1/!UART0_RTS!/FTM0_CH4/EWM_IN/GPIO_BSM_FRAME  (via drill 0.25)
  Top 0.178: J1.P$11 3.19,17.25 3.15,17.29 v2.01,17.29 | U1.P$11 22.42,19.73 v22.2,19.95 | v7.6,26.16 7.6,26.92 7.34,27.18 TP9.TP
  Route2 0.178: v22.2,19.95 22.2,20.18 22.14,20.24 22.14,20.91 22.33,21.1 22.45,21.22 24.49,21.22 24.61,21.35 24.61,24.4 24.23,24.78 8.36,24.78 3.66,20.08 3.66,17.79 3.15,17.29 v2.01,17.29
  Route3 0.178: v7.6,26.16 7.6,21.59 7.34,21.33 7.34,17.91 6.71,17.27 2.02,17.27 v2.01,17.29
PTD5/ADC0_SE6B/SPI0_PCS2/!UART0_CTS!/!UART0_COL!/FTM0_CH5/!EWM_OUT  (via drill 0.25)
  Top 0.178: v21.56,20.46 21.56,19.7 21.92,19.35 U1.P$12 | J1.P$13 2.67,16.75 v2.64,16.78 | v9.88,26.16 9.88,26.67 TP10.TP | IC1.1 14.58,27.43 v14.08,27.43
  Route2 0.178: v21.56,20.46 21.56,20.97 22.2,21.6 23.98,21.6 24.23,21.86 24.23,23.38 23.98,23.64 23.22,23.64 22.45,24.4 9.88,24.4 7.21,21.73 7.21,20.21 6.07,19.06 5.05,18.05 4.04,17.03 3.78,16.78 v2.64,16.78
  Route3 0.178: v2.64,16.78 2.66,16.76 7.09,16.76 9.88,19.56 v9.88,26.16 9.88,26.29 10.52,26.92 12.3,26.92 12.81,27.43 v14.08,27.43
PTD6/LLWU_P15/ADC0_SE7B/SPI0_PCS3/UART0_RX/FTM0_CH6/FTM0_FLT0  (via drill 0.25)
  Top 0.178: v20.93,20.08 20.93,19.83 21.42,19.34 U1.P$13 | J1.P$15 2.03,16.25 v2.01,16.27 | TP11.TP 11.28,26.29 v11.15,26.16
  Route2 0.178: v20.93,20.08 20.93,20.97 20.68,21.22 20.68,23.38 20.04,24.02 10.01,24.02 7.59,21.6 7.59,20.08 6.32,18.81 5.44,17.92 4.55,17.03 3.78,16.27 v2.01,16.27
  Route3 0.178: v11.15,26.16 11.15,25.4 10.52,24.76 10.52,19.43 10.27,19.18 7.34,16.25 2.02,16.25 v2.01,16.27
PTD7/MADC0_SE22/CMT_IRO/UART0_TX/FTM0_CH7/FTM0_FLT1  (via drill 0.25)
  Top 0.178: v20.17,20.46 20.17,19.83 20.92,19.08 U1.P$14 | J1.P$17 2.65,15.75 v2.64,15.76 1.64,15.76 1.25,16.15 1.25,18.79 2.01,19.56 TP12.TP
  Route2 0.178: v20.17,20.46 20.17,23.13 19.66,23.64 10.13,23.64 7.98,21.48 7.98,19.95 6.58,18.56 5.82,17.79 4.93,16.91 3.78,15.76 v2.64,15.76
PTE0/MADC0_SE10/SPI1_PCS1/UART1_TX/MTRACE_CLKOUT/I2C1_SDA/RTC_CLKOUT  (via drill 0.25)
  Top 0.178: v19.15,20.21 20.27,19.09 20.29,19.07 U1.P$15 | J1.P$19 v2.01,15.25
  Route2 0.178: v19.15,20.21 19.15,22.87 18.77,23.25 10.26,23.25 8.36,21.35 8.36,19.83 6.71,18.18 5.31,16.78 3.78,15.25 v2.01,15.25
  Bottom 0.178: J2.P$12 8.9,10.27 9.5,9.67 19.41,9.67 20.68,10.94 20.68,11.7 20.68,18.68 v19.15,20.21
PTE1/LLWU_P0/MADC0_SE11/SPI1_SOUT/UART1_RX/MTRACE_D3/I2C1_SCL/SPI1_SIN  (via drill 0.25)
  Top 0.178: v18.26,19.83 18.64,19.83 19.53,18.94 19.53,18.18 19.89,17.81 U1.P$16 | J1.P$21 v2.65,14.75 v2.64,14.75
  Route2 0.178: v18.26,19.83 18.26,22.24 17.63,22.87 10.39,22.87 8.74,21.22 8.74,19.7 3.78,14.75 v2.64,14.75
  Bottom 0.178: J2.P$20 10.9,11.69 11.4,11.19 16.23,11.19 16.48,11.44 16.48,18.43 17.88,19.83 v18.26,19.83
PTE2/LLWU_P1/MADC0_DP1/SPI1_SCK/!UART1_CTS!/MTRACE_D2  (via drill 0.25)
  Top 0.178: v18.01,19.06 18.64,19.06 18.77,18.94 19.15,18.56 19.15,18.05 19.82,17.38 19.89,17.31 U1.P$17 | J1.P$23 2.02,14.25 v2.01,14.24
  Route2 0.178: v18.01,19.06 17.75,19.32 17.75,22.11 17.37,22.49 10.52,22.49 9.12,21.1 9.12,19.57 8.99,19.45 3.78,14.24 v2.01,14.24
  Bottom 0.178: J2.P$18 10.4,10.92 10.52,10.81 15.09,10.81 16.61,10.81 16.87,11.06 16.87,18.18 17.75,19.06 v18.01,19.06
PTE3/MADC0_DM1/SPI1_SIN/!UART1_RTS!/MTRACE_D1/SPI1_SOUT  (via drill 0.25)
  Top 0.178: J1.P$25 3.17,13.75 3.15,13.73 v2.64,13.73 | U1.P$18 19.75,16.81 19.68,16.88 18.57,18 18.57,18.05 18.57,18.25 v18.57,18.3
  Route2 0.178: v2.64,13.73 3.78,13.73 5.44,15.38 13.69,15.38 13.95,15.13 14.71,15.13 14.96,15.38 15.34,15.76 15.85,16.27 16.1,16.52 17.88,18.3 v18.57,18.3
  Bottom 0.178: J2.P$16 9.9,10.92 10.39,10.43 16.36,10.43 16.74,10.43 17.25,10.94 17.25,17.92 17.63,18.3 v18.57,18.3
PTE4/LLWU_P2/SPI1_PCS0/MTRACE_D0  (via drill 0.25)
  Top 0.178: v18.26,17.54 19.3,16.51 19.42,16.38 19.49,16.31 U1.P$19 | J1.P$27 2.92,13.25 2.9,13.22 v2.01,13.22
  Route2 0.178: v18.26,17.54 17.63,17.54 14.83,14.75 14.71,14.62 14.71,13.86 14.45,13.6 14.2,13.35 13.18,13.35 3.66,13.35 3.53,13.22 v2.01,13.22
  Bottom 0.178: J2.P$14 9.4,10.65 10.01,10.05 19.02,10.05 19.15,10.05 20.17,11.06 20.17,11.95 20.17,15.76 18.52,17.41 18.39,17.54 v18.26,17.54
PTE16/ADC0_SE4A/SPI0_PCS0/UART2_TX/FTM_CLKIN0/FTM0_FLT3  (via drill 0.25)
  Top 0.178: v18.37,16.65 18.39,16.65 18.9,16.14 19.02,16.02 19.66,15.38 19.73,15.31 U1.P$21 | J1.P$29 2.68,12.75 v2.64,12.71
  Route2 0.178: v18.37,16.65 17.25,16.65 15.21,14.62 15.09,14.49 15.09,13.73 14.33,12.97 13.31,12.97 3.91,12.97 3.66,12.71 v2.64,12.71
PTE17/ADC0_SE5A/SPI0_SCK/UART2_RX/FTM_CLKIN1/LPTMR0_ALT3  (via drill 0.25)
  Top 0.178: v18.39,15.89 19.4,14.88 19.46,14.81 U1.P$22 | J1.P$31 3.19,12.25 3.15,12.21 v2.01,12.21
  Route2 0.178: v18.39,15.89 16.99,15.89 15.47,14.37 15.47,13.6 14.71,12.84 14.45,12.59 13.44,12.59 4.17,12.59 3.78,12.21 v2.01,12.21
PTE18/ADC0_SE6A/SPI0_SOUT/!UART2_CTS!/I2C0_SDA  (via drill 0.25)
  Top 0.178: v18.34,15.13 18.39,15.13 19.14,14.38 19.2,14.31 U1.P$23 | J1.P$33 2.82,11.75 2.77,11.7 v2.64,11.7
  Route2 0.178: v18.34,15.13 16.74,15.13 15.85,14.24 15.85,13.48 14.83,12.46 14.58,12.21 13.56,12.21 4.42,12.21 3.91,11.7 v2.64,11.7
PTE19/ADC0_SE7A/SPI0_SIN/!UART2_RTS!/I2C0_SCL  (via drill 0.25)
  Top 0.178: v18.14,14.24 18.52,14.24 18.87,13.88 18.94,13.81 U1.P$24 | J1.P$35 3.21,11.25 3.15,11.19 v2.01,11.19
  Route2 0.178: v18.14,14.24 16.48,14.24 16.23,13.98 16.23,13.22 14.83,11.82 4.67,11.82 4.04,11.19 v2.01,11.19
RF_OUTN
  Top 0.178: L1.P$1 29.88,15.56 29.69,15.38 28.11,15.38 U1.P$50
RF_OUTP
  Top 0.178: L2.P$1 29.84,14.73 29.69,14.87 28.1,14.87 U1.P$49
RFN
  Top 0.178: R4.P$2 34.17,15.56 U3.P$5
RFP
  Top 0.178: R5.P$2 33.82,14.86 34.01,14.86 34.02,14.86 U3.P$6
RX_SWITCH  (via drill 0.25)
  Top 0.178: U3.P$2 33.34,17.74 R6.P$1 C21.P$1 | C21.P$1 | U1.P$46 29.15,13.31 v29.18,13.35 29.71,13.35 29.82,13.46 31.73,13.46 32.24,12.95 32.24,11.49 TP7.TP | C21.P$1 32.36,17.66 v32.36,16.78
  Route3 0.178: v29.18,13.35 27.66,13.35 26.64,14.37 26.64,18.18 27.79,19.32 29.18,20.71 32.61,20.71 32.74,20.71 33.25,20.21 33.25,19.7 32.36,18.81 v32.36,16.78
TAMPER/!RTC_WAKEUP
  Top 0.178: R1.2 19.81,10.17 19.82,10.18 19.95,10.31 20.82,11.19 U1.P$29
TX_SWITCH  (via drill 0.25)
  Top 0.178: U3.P$24 34.95,18.85 34.5,19.3 33.8,19.3 33.3,19.8 33.3,19.95 | U1.P$47 28.38,13.81 28.68,14.11 v29.18,14.11 29.3,14.22 32.49,14.22 33.49,13.22 TP6.TP | v32.36,19.95 33.3,19.95 | 33.3,19.95 C30.P$2
  Route3 0.178: v29.18,14.11 27.66,14.11 27.15,14.62 27.15,17.92 28.04,18.81 29.18,19.95 29.31,19.95 v32.36,19.95
VCC_DIG_PA
  Top 0.178: U3.P$10 C23.P$1 35.66,12.79 | C22.P$2 U3.P$8 C22.P$2 35.66,12.79 | L3.P$1 35.65,12.77 35.66,12.79
VIN
  Top 0.178: 10.43,10.55 9.89,10.55 9.77,10.43 9.06,10.43 8.99,10.5 | U4.3 16.57,7.66 16.6,7.63
  Top 0.305: J1.P$40 9.77,10.43 J1.P$38 | 16.6,7.5 16.7,7.4 16.7,7.51
  Top 0.711: 8.93,10.5 8.99,10.5 12.17,10.5 14.92,7.75 16.59,7.75 16.6,7.76 16.6,7.63 16.6,7.5
XTAL32
  Top 0.178: U1.P$30 21.42,9.32 21.39,9.29 21.1,9 20.3,9 20.1,8.8 20.1,7.8 X1.P$2 19.56,7.26 C4.1
XTAL_32M
  Top 0.178: C1.1 30.6,23.4 32.2,23.4 32.4,23.2 32.4,21 31.8,20.4 29.8,20.4 28.1,18.7 28.04,18.64 U1.P$56
  Top 0.254: 30.6,23.4 30.3,23.7 X2.P$3

### Text on the board
bPlace: KW2CPU.v1.0 | JTAG